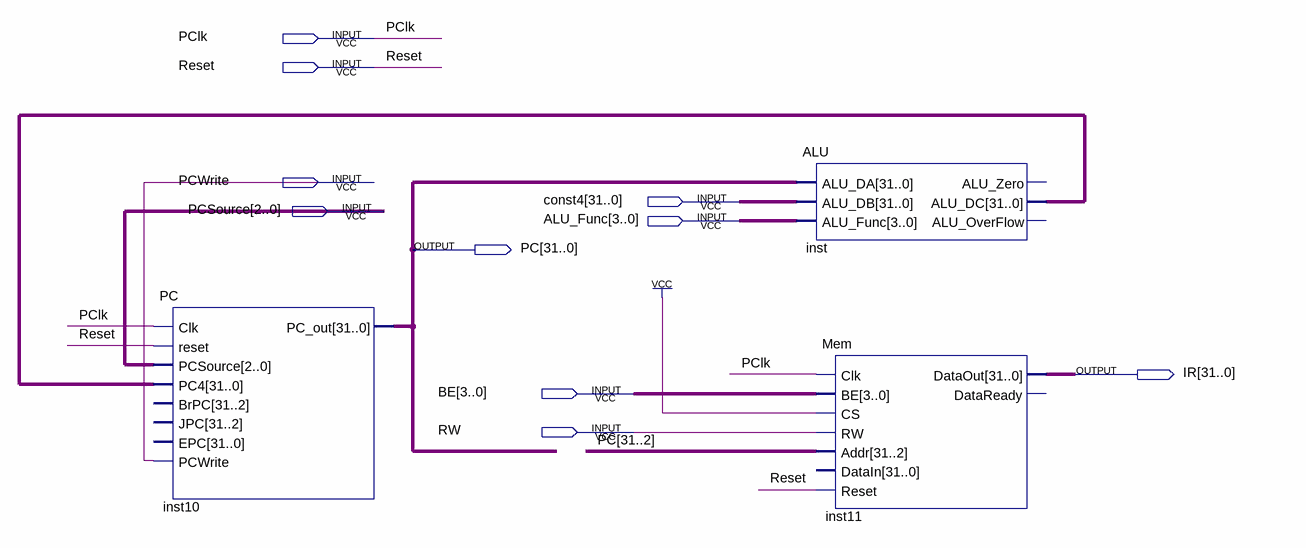
[diagram p0: schematic sheet]
// Quartus schematic quzhi.bdf as structural Verilog: 3 symbols, 10 pins
module quzhi (
  input  PClk,
  input  Reset,
  input  PCWrite,
  input  [31:0] const4,
  input  [2:0] PCSource,
  input  [3:0] ALU_Func,
  input  [3:0] BE,
  input  RW,
  output [31:0] PC,
  output [31:0] IR
);

  wire [31:0] inst_alu_dc;

  PC inst10 (
    .Clk(PClk), .reset(Reset), .PCSource(PCSource), .PC4(inst_alu_dc), .PCWrite(PCWrite), .PC_out(PC));  // open: BrPC, JPC, EPC
  ALU inst (.ALU_DA(PC), .ALU_DB(const4), .ALU_Func(ALU_Func), .ALU_DC(inst_alu_dc));  // open: ALU_Zero, ALU_OverFlow
  Mem inst11 (
    .Clk(PClk), .BE(BE), .CS(1'b1), .RW(RW), .Addr(PC[31:2]), .Reset(Reset), .DataOut(IR));  // open: DataIn, DataReady
endmodule
